# Altium project ARMBrain.PrjPCB
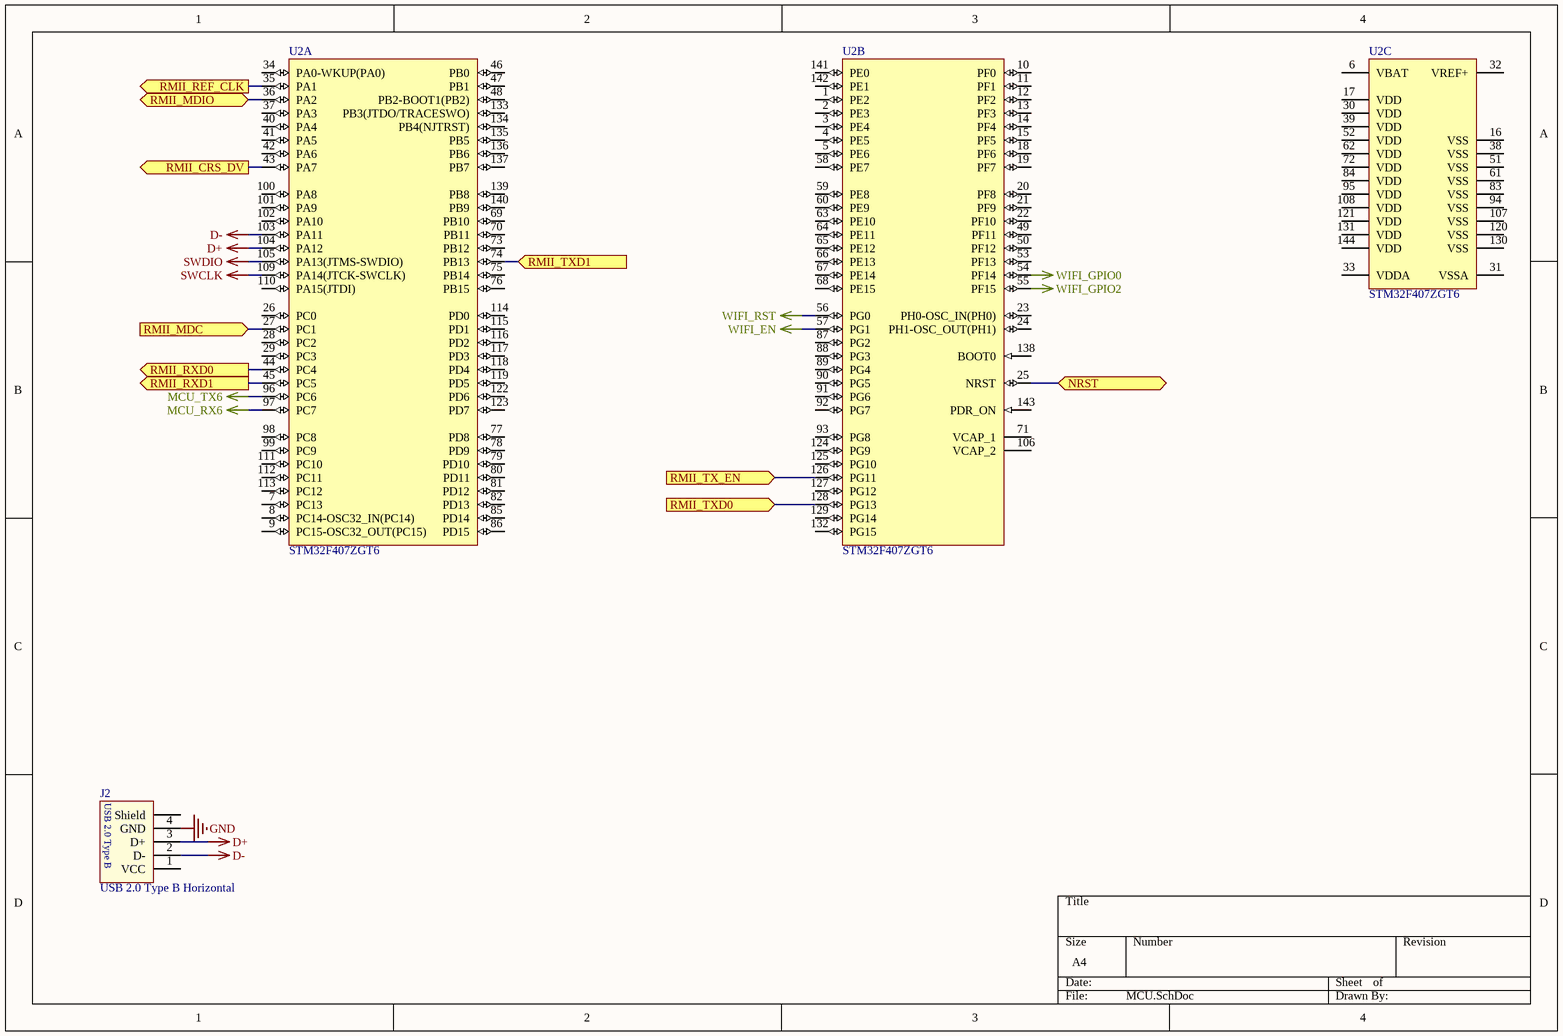
[diagram p0: MCU.SchDoc]
4 sheets, 67 parts. Net scope: flat (ports and power ports of the same name join across sheets).
Board file: ARMBrain.PcbDoc
Sheets:
  MCU.SchDoc
  Debugging.SchDoc
  ESP8266.SchDoc
  Ethernet.SchDoc

## Sheet MCU.SchDoc
size A4

### Parts
J2  USB 2.0 Type B Horizontal  [61400416121]
U2  STM32F407ZGT6  [STM-LQFP144_N]  (parts A,B,C of 3)

### Ports
NRST, RMII_CRS_DV (out), RMII_MDC (in), RMII_MDIO (bidir), RMII_REF_CLK (out), RMII_RXD0 (out), RMII_RXD1 (out), RMII_TX_EN (in), RMII_TXD0 (in), RMII_TXD1 (in)

### Nets
D+: J2.3(D+) U2.104(PA12)
D-: J2.2(D-) U2.103(PA11)
GND: J2.4(GND)  [project net RJ45_Shield]
MCU_RX6: U2.97(PC7)
MCU_TX6: U2.96(PC6)
SWCLK: U2.109(PA14(JTCK-SWCLK))
SWDIO: U2.105(PA13(JTMS-SWDIO))
WIFI_EN: U2.57(PG1)
WIFI_GPIO0: U2.54(PF14)
WIFI_GPIO2: U2.55(PF15)
WIFI_RST: U2.56(PG0)
NetR16_2: U2.44(PC4) ; port RMII_RXD0
NetR17_2: U2.45(PC5) ; port RMII_RXD1
NetR24_2: U2.43(PA7) ; port RMII_CRS_DV
NetR25_1: U2.36(PA2) ; port RMII_MDIO
NetR27_2: U2.35(PA1) ; port RMII_REF_CLK
NetU2_25: U2.25(NRST) ; port NRST
NetU2_27: U2.27(PC1) ; port RMII_MDC
NetU2_74: U2.74(PB13) ; port RMII_TXD1
NetU2_126: U2.126(PG11) ; port RMII_TX_EN
NetU2_128: U2.128(PG13) ; port RMII_TXD0

Not connected (* = marked no-connect by the designer): J2 1(VCC) Shell(Shield); U2 1(PE2) 2(PE3) 3(PE4) 4(PE5) 5(PE6) 6(VBAT) 7(PC13) 8(PC14-OSC32_IN(PC14)) 9(PC15-OSC32_OUT(PC15)) 10(PF0) 11(PF1) 12(PF2) 13(PF3) 14(PF4) 15(PF5) 16(VSS) 17(VDD) 18(PF6) 19(PF7) 20(PF8) 21(PF9) 22(PF10) 23(PH0-OSC_IN(PH0)) 24(PH1-OSC_OUT(PH1)) 26(PC0) 28(PC2) 29(PC3) 30(VDD) 31(VSSA) 32(VREF+) 33(VDDA) 34(PA0-WKUP(PA0)) 37(PA3) 38(VSS) 39(VDD) 40(PA4) 41(PA5) 42(PA6) 46(PB0) 47(PB1) 48(PB2-BOOT1(PB2)) 49(PF11) 50(PF12) 51(VSS) 52(VDD) 53(PF13) 58(PE7) 59(PE8) 60(PE9) 61(VSS) 62(VDD) 63(PE10) 64(PE11) 65(PE12) 66(PE13) 67(PE14) 68(PE15) 69(PB10) 70(PB11) 71(VCAP_1) 72(VDD) 73(PB12) 75(PB14) 76(PB15) 77(PD8) 78(PD9) 79(PD10) 80(PD11) 81(PD12) 82(PD13) 83(VSS) 84(VDD) 85(PD14) 86(PD15) 87(PG2) 88(PG3) 89(PG4) 90(PG5) 91(PG6) 92(PG7) 93(PG8) 94(VSS) 95(VDD) 98(PC8) 99(PC9) 100(PA8) 101(PA9) 102(PA10) 106(VCAP_2) 107(VSS) 108(VDD) 110(PA15(JTDI)) 111(PC10) 112(PC11) 113(PC12) 114(PD0) 115(PD1) 116(PD2) 117(PD3) 118(PD4) 119(PD5) 120(VSS) 121(VDD) 122(PD6) 123(PD7) 124(PG9) 125(PG10) 127(PG12) 129(PG14) 130(VSS) 131(VDD) 132(PG15) 133(PB3(JTDO/TRACESWO)) 134(PB4(NJTRST)) 135(PB5) 136(PB6) 137(PB7) 138(BOOT0) 139(PB8) 140(PB9) 141(PE0) 142(PE1) 143(PDR_ON) 144(VDD)

### Notes on the sheet
- (in symbol USB 2.0 Type B Horizontal) USB 2.0 Type B

### Library data of the parts
J2 = USB 2.0 Type B Horizontal: USB 2.0 Type B Horizontal WR-COM; Interface Type: Type B; Sub-Family: USB 2.0; Gender: Receptacle; ComponentLink1Description: Manufacturer; ComponentLink1URL: http://www.we-online.de; ComponentLink2Description: Datasheet; ComponentLink2URL: http://katalog.we-online.de/em/datasheet/61400416121.pdf; Part Number: 61400416121; Published Date: April 2017; Publisher: Wurth Elektronik; Type: Horizontal; Construction: THT
U2 = STM32F407ZGT6: ARM Cortex-M4 32-bit MCU+FPU, 210 DMIPS, 1024 kB Flash, 192 kB Internal RAM, 114 I/Os, 144-pin LQFP, -40 to 85 degC, Tray; Manufacturer: STMicroelectronics; D/A Converter: 2x12-bit; FLASH Size (Prog) (kB): 1024; I/Os (High Current): 114; Internal RAM Size (kB): 192; Operating Frequency(F) (Processor speed) (MHz): 168; Supply Voltage(Vcc) max (V): 3.6; Supply Voltage(Vcc) min (V): 1.8; DatasheetVersion: Rev. 4; PackageVersion: Rev. 4, 06/2013; PackageReference: LQFP144; PackageDescription: 144-Pin Low Profile Quad Flat Package, 20 x 20 mm Body, 0.5 mm Pitch; Supplier 1: Digi-Key; Supplier Part Number 1: 497-11766-ND; Supplier 2: Newark; Supplier Part Number 2: 73T2334; Supplier 3: Mouser; Supplier Part Number 3: 511-STM32F407ZGT6; Core: ARM Cortex-M4; Packing: Tray; Mounting Technology: Surface Mount; PartNumber: STM32F407ZGT6; ComponentLink1Description: Manufacturer URL; ComponentLink1URL: http://www.st.com/web/en/home.html; ComponentLink2Description: Datasheet; ComponentLink2URL: http://www.st.com/st-web-ui/static/active/en/resource/technical/document/datasheet/DM00037051.pdf; ComponentLink3Description: Package Specification; ComponentLink3URL: http://www.st.com/st-web-ui/static/active/en/resource/technical/document/datasheet/DM00037051.pdf

## Sheet Debugging.SchDoc
size A4
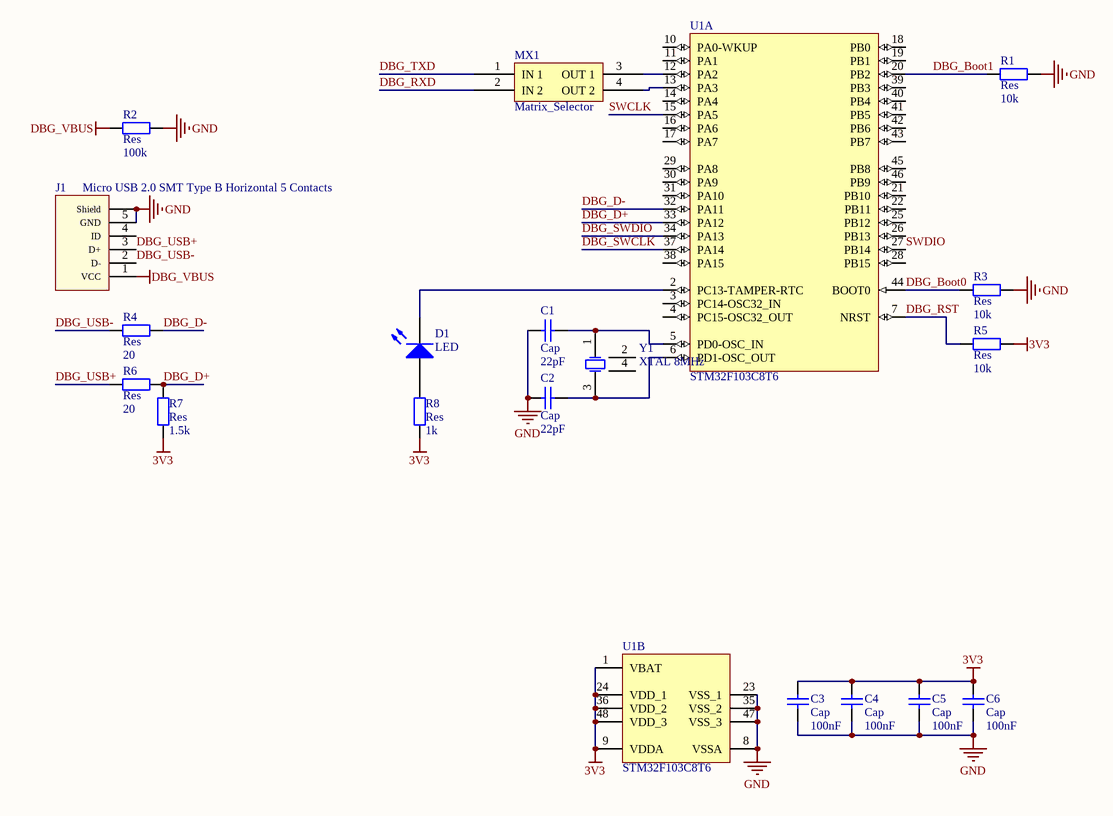
[diagram p1: Debugging.SchDoc]

### Parts
C1  Cap  value 22pF  [C0603]
C2  Cap  value 22pF  [C0603]
C3  Cap  value 100nF  [C0603]
C4  Cap  value 100nF  [C0603]
C5  Cap  value 100nF  [C0603]
C6  Cap  value 100nF  [C0603]
D1  LED  [0805_Led]
J1  Micro USB 2.0 SMT Type B Horizontal 5 Contacts  [629105136821]
MX1  Matrix_Selector  [Matrix_Selector]
R1  Res  value 10k  [R0805]
R2  Res  value 100k  [R0805]
R3  Res  value 10k  [R0805]
R4  Res  value 20  [R0805]
R5  Res  value 10k  [R0805]
R6  Res  value 20  [R0805]
R7  Res  value 1.5k  [R0805]
R8  Res  value 1k  [R0805]
U1  STM32F103C8T6  [STM-LQFP48_N]  (parts A,B of 2)
Y1  XTAL 8MHz  [SMD-3225_4P]

### Nets
3V3: C3.2 C4.2 C5.2 C6.2 R5.2 R7.1 R8.1 U1.1(VBAT) U1.9(VDDA) U1.24(VDD_1) U1.36(VDD_2) U1.48(VDD_3)
DBG_VBUS: J1.1(VCC) R2.2
GND: C1.1 C2.1 C3.1 C4.1 C5.1 C6.1 J1.5(GND) J1.Shell(Shield) R1.2 R2.1 R3.2 U1.8(VSSA) U1.23(VSS_1) U1.35(VSS_2) U1.47(VSS_3)  [project net RJ45_Shield]
DBG_Boot0: R3.1 U1.44(BOOT0)
DBG_Boot1: R1.1 U1.20(PB2)
DBG_D+: R6.2 R7.2 U1.33(PA12)
DBG_D-: R4.2 U1.32(PA11)
DBG_RST: R5.1 U1.7(NRST)
DBG_RXD: MX1.2(IN_2)
DBG_SWCLK: U1.37(PA14)
DBG_SWDIO: U1.34(PA13)
DBG_TXD: MX1.1(IN_1)
DBG_USB+: J1.3(D+) R6.1
DBG_USB-: J1.2(D-) R4.1
SWCLK: U1.15(PA5)
SWDIO: U1.27(PB14)
NetC1_2: C1.2 U1.5(PD0-OSC_IN) Y1.1(OSC1)
NetC2_2: C2.2 U1.6(PD1-OSC_OUT) Y1.3(OSC2)
NetD1_1: D1.1(K) U1.2(PC13-TAMPER-RTC)
NetD1_2: D1.2(A) R8.2
NetMX1_3: MX1.3(OUT_1) U1.12(PA2)
NetMX1_4: MX1.4(OUT_2) U1.13(PA3)

Not connected (* = marked no-connect by the designer): J1 4(ID); U1 3(PC14-OSC32_IN) 4(PC15-OSC32_OUT) 10(PA0-WKUP) 11(PA1) 14(PA4) 16(PA6) 17(PA7) 18(PB0) 19(PB1) 21(PB10) 22(PB11) 25(PB12) 26(PB13) 28(PB15) 29(PA8) 30(PA9) 31(PA10) 38(PA15) 39(PB3) 40(PB4) 41(PB5) 42(PB6) 43(PB7) 45(PB8) 46(PB9); Y1 2(OSC1) 4(OSC1)

### Library data of the parts
C1-C6 = Cap: Capacitor; Published: 8-Jun-2000; LatestRevisionDate: 17-Jul-2002; LatestRevisionNote: Re-released for DXP Platform.; PackageReference: RAD-0.3; Publisher: Altium Limited; PackageDescription: Radial Cap, Thru-Hole; 2 Leads; 0.3 in Pin Spacing
D1 = LED: SMD LED; PCB_Layout: Complies with manufacturer's recommendation.; Published: 14-Mar-2008; DatasheetVersion: Mar-2007; PackageVersion: Mar-2007; PackageReference: LWP4SG; Publisher: Altium Limited; PackageDescription: White LED; 2 Reverse Gullwing Leads, Body 1.9 x 0.875mm (Dia.xH); ComponentLink1Description: Manufacturer Link; ComponentLink1URL: http://www.osram-os.com/; ComponentLink2Description: Datasheet; ComponentLink2URL: http://catalog.osram-os.com/catalogue/catalogue.do;jsessionid=AD571800CED0208623E7FAFDF556DB1C?act=downloadFile&favOid=020000030001e106000200b6
J1 = Micro USB 2.0 SMT Type B Horizontal 5 Contacts: Micro USB 2.0 SMT Type B Horizontal 5 Contacts WR-COM; Interface Type: Type B; Gender: Receptacle; ComponentLink1Description: Manufacturer; ComponentLink1URL: http://www.we-online.de; ComponentLink2Description: Datasheet; ComponentLink2URL: http://katalog.we-online.de/em/datasheet/629105136821.pdf; Part Number: 629105136821; Published Date: April 2017; Publisher: Wurth Elektronik; Sub-Family: Micro USB 2.0; Type: Horizontal; Construction: SMT
R1-R8 = Res: Resistor; Published: 8-Jun-2000; LatestRevisionDate: 17-Jul-2002; LatestRevisionNote: Re-released for DXP Platform.; PackageReference: AXIAL-0.4; Publisher: Altium Limited; PackageDescription: Axial Device, Thru-Hole; 2 Leads; 0.4 in Pin Spacing
U1 = STM32F103C8T6: ARM Cortex-M3 32-bit MCU, 64 KB Flash, 20 KB Internal RAM, 37 I/Os, 48-pin LQFP, -40 to 85 degC, Tray; A/D Converter: 2x12-bit (10 Channel); FLASH Size (Prog) (kB): 64; I/Os (High Current): 37; Internal RAM Size (kB): 20; Operating Frequency(F) (Processor speed) (MHz): 72; Supply Voltage(Vcc) min (V): 2; DatasheetVersion: Rev. 16; PackageVersion: Rev. 6, 06/2013; PackageReference: LQFP48; PackageDescription: 48-Pin Low Profile Quad Flat Package, 7 x 7 mm Body, 0.5 mm Pitch; Supplier 1: Digi-Key; Supplier Part Number 1: 497-6063-ND; Supplier 2: Farnell; Supplier Part Number 2: 1447637; Supplier 3: Newark; Supplier Part Number 3: 59M2182; Supplier 4: Newark; Supplier Part Number 4: 57P1222; Supplier 5: Mouser; Supplier Part Number 5: 511-STM32F103C8T6; Core: ARM Cortex-M3; Packing: Tray; Mounting Technology: Surface Mount; PartNumber: STM32F103C8T6; ComponentLink1Description: Manufacturer URL; ComponentLink1URL: http://www.st.com/web/en/home.html; ComponentLink2Description: Datasheet; ComponentLink2URL: http://www.st.com/st-web-ui/static/active/en/resource/technical/document/datasheet/CD00161566.pdf; ComponentLink3Description: Package Specification; ComponentLink3URL: http://www.st.com/st-web-ui/static/active/en/resource/technical/document/datasheet/DM00058181.pdf
Y1 = XTAL_SMD: Crystal; Published: 8-Jun-2000; LatestRevisionDate: 17-Jul-2002; LatestRevisionNote: Re-released for DXP Platform.; PackageReference: R38; Publisher: Altium Limited; PackageDescription: Crystal, Thru-Hole; 2 Leads; Body 3.1 x 8.2 mm (Dia.xH)

## Sheet ESP8266.SchDoc
size A4
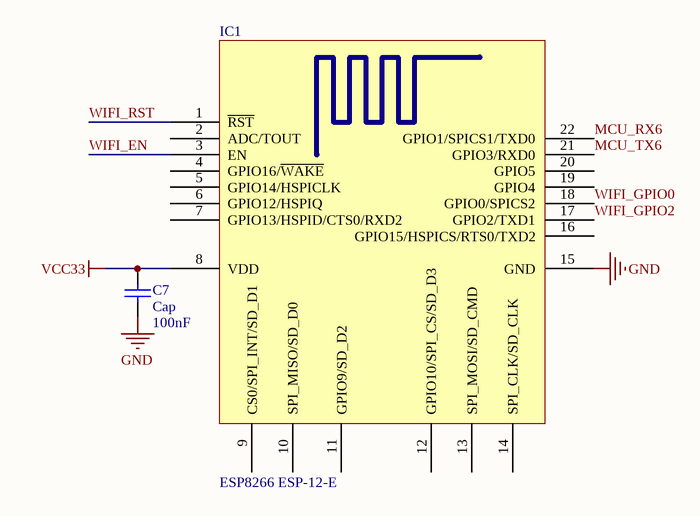
[diagram p2: ESP8266.SchDoc]

### Parts
C7  Cap  value 100nF  [C0603]
IC1  ESP8266 ESP-12-E  [ESP8266 ESP-12-E]

### Nets
GND: C7.1 IC1.15(GND)  [project net RJ45_Shield]
VCC33: C7.2 IC1.8(VDD)
MCU_RX6: IC1.22(GPIO1/SPICS1/TXD0)
MCU_TX6: IC1.21(GPIO3/RXD0)
WIFI_EN: IC1.3(EN)
WIFI_GPIO0: IC1.18(GPIO0/SPICS2)
WIFI_GPIO2: IC1.17(GPIO2/TXD1)
WIFI_RST: IC1.1(~{RST})

Not connected (* = marked no-connect by the designer): IC1 2(ADC/TOUT) 4(GPIO16/~{WAKE}) 5(GPIO14/HSPICLK) 6(GPIO12/HSPIQ) 7(GPIO13/HSPID/CTS0/RXD2) 9(CS0/SPI_INT/SD_D1) 10(SPI_MISO/SD_D0) 11(GPIO9/SD_D2) 12(GPIO10/SPI_CS/SD_D3) 13(SPI_MOSI/SD_CMD) 14(SPI_CLK/SD_CLK) 16(GPIO15/HSPICS/RTS0/TXD2) 19(GPIO4) 20(GPIO5)

### Library data of the parts
C7 = Cap: Capacitor; Published: 8-Jun-2000; LatestRevisionDate: 17-Jul-2002; LatestRevisionNote: Re-released for DXP Platform.; PackageReference: RAD-0.3; Publisher: Altium Limited; PackageDescription: Radial Cap, Thru-Hole; 2 Leads; 0.3 in Pin Spacing

## Sheet Ethernet.SchDoc
size A4
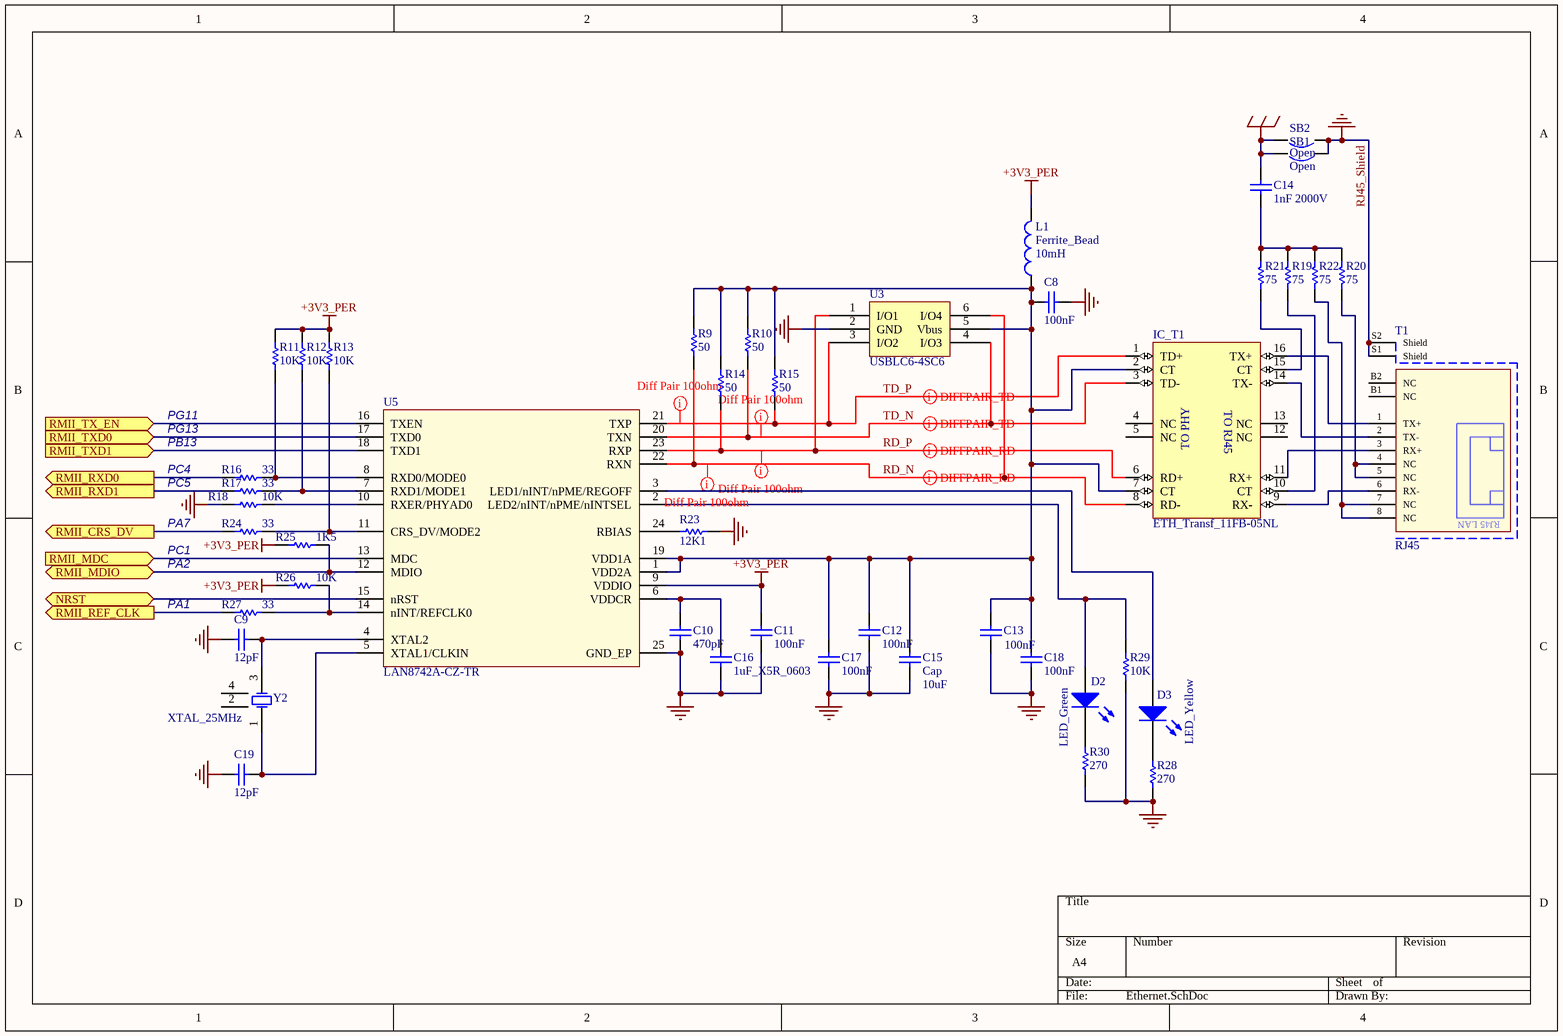
[diagram p3: Ethernet.SchDoc]

### Parts
C8  100nF  [C0603]
C9  12pF  [C0603]
C10  470pF  [C0603]
C11  100nF  [C0603]
C12  100nF  [C0603]
C13  100nF  [C0603]
C14  1nF 2000V  [C1206]
C15  Cap  value 10uF  [C0805]
C16  1uF_X5R_0603  [C0603]
C17  100nF  [C0603]
C18  100nF  [C0603]
C19  12pF  [C0603]
D2  LED_Green  [0603_LED]
D3  LED_Yellow  [0603_LED]
IC_T1  ETH_Transf_11FB-05NL  [ETH_Transf 11FB-05NL]
L1  Ferrite_Bead  value 10mH  [0805]
R9  50  [R0603]
R10  50  [R0603]
R11  10K  [R0603]
R12  10K  [R0603]
R13  10K  [R0603]
R14  50  [R0603]
R15  50  [R0603]
R16  33  [R0603]
R17  33  [R0603]
R18  10K  [R0603]
R19  75  [R0603]
R20  75  [R0603]
R21  75  [R0603]
R22  75  [R0603]
R23  12K1  [R0805]
R24  33  [R0603]
R25  1K5  [R0603]
R26  10K  [R0603]
R27  33  [R0603]
R28  270  [R0603]
R29  10K  [R0603]
R30  270  [R0603]
SB1  Open  [SB_0603]
SB2  Open  [SB_0603]
T1  RJ45  [RJ45_ETH]
U3  USBLC6-4SC6  [SOT23-6L]
U5  LAN8742A-CZ-TR  [QFN24_0R5_4X4]
Y2  XTAL_25MHz  [SMD-3225_4P]

### Ports
NRST, RMII_CRS_DV (out), RMII_MDC (in), RMII_MDIO (bidir), RMII_REF_CLK (out), RMII_RXD0 (out), RMII_RXD1 (out), RMII_TX_EN (in), RMII_TXD0 (in), RMII_TXD1 (in)

### Nets
+3V3_PER: C11.2 L1.2 R11.1 R12.1 R13.1 R25.2 R26.1 U5.9(VDDIO)
EGND: C14.1 SB1.1 SB2.1
RJ45_Shield: C8.1 C9.2 C10.1 C11.1 C12.1 C13.1 C15.1 C16.2 C17.1 C18.1 C19.2 R18.2 R23.2 R28.2 R29.2 R30.2 SB1.2 SB2.2 T1.S1(Shield) T1.S2(Shield) U3.2(GND) U5.25(GND_EP)  [also labelled GND]
RD_N: IC_T1.8(RD-) R9.1 U3.6(I/O4) U5.22(RXN)
RD_P: IC_T1.6(RD+) R14.1 U3.1(I/O1) U5.23(RXP)
TD_N: IC_T1.3(TD-) R10.1 U3.4(I/O3) U5.20(TXN)
TD_P: IC_T1.1(TD+) R15.1 U3.3(I/O2) U5.21(TXP)
NetC8_2: C8.2 C12.2 C13.2 C15.2 C17.2 C18.2 IC_T1.2(CT) IC_T1.7(CT) L1.1 R9.2 R10.2 R14.2 R15.2 U3.5(Vbus) U5.1(VDD2A) U5.19(VDD1A)
NetC9_1: C9.1 U5.4(XTAL2) Y2.3(OSC2)
NetC10_2: C10.2 C16.1 U5.6(VDDCR)
NetC14_2: C14.2 R19.1 R20.1 R21.1 R22.1
NetC19_1: C19.1 U5.5(XTAL1/CLKIN) Y2.1(OSC1)
NetD2_1: D2.1(K) R30.1
NetD2_2: D2.2(A) R29.1 U5.2(LED2/nINT/nPME/nINTSEL)
NetD3_1: D3.1(K) R28.1
NetD3_2: D3.2(A) U5.3(LED1/nINT/nPME/REGOFF)
NetIC_T1_9: IC_T1.9(RX-) T1.6(RX-)
NetIC_T1_10: IC_T1.10(CT) R19.2
NetIC_T1_11: IC_T1.11(RX+) T1.3(RX+)
NetIC_T1_14: IC_T1.14(TX-) T1.2(TX-)
NetIC_T1_15: IC_T1.15(CT) R21.2
NetIC_T1_16: IC_T1.16(TX+) T1.1(TX+)
NetR11_2: R11.2 R16.1 U5.8(RXD0/MODE0)
NetR12_2: R12.2 R17.1 U5.7(RXD1/MODE1)
NetR13_2: R13.2 R24.1 U5.11(CRS_DV/MODE2)
NetR16_2: R16.2 ; port RMII_RXD0
NetR17_2: R17.2 ; port RMII_RXD1
NetR18_1: R18.1 U5.10(RXER/PHYAD0)
NetR20_2: R20.2 T1.4(NC) T1.5(NC)
NetR22_2: R22.2 T1.7(NC) T1.8(NC)
NetR23_1: R23.1 U5.24(RBIAS)
NetR24_2: R24.2 ; port RMII_CRS_DV
NetR25_1: R25.1 U5.12(MDIO) ; port RMII_MDIO
NetR26_2: R26.2 R27.1 U5.14(nINT/REFCLK0)
NetR27_2: R27.2 ; port RMII_REF_CLK
NetU2_25: U5.15(nRST) ; port NRST
NetU2_27: U5.13(MDC) ; port RMII_MDC
NetU2_74: U5.18(TXD1) ; port RMII_TXD1
NetU2_126: U5.16(TXEN) ; port RMII_TX_EN
NetU2_128: U5.17(TXD0) ; port RMII_TXD0

Not connected (* = marked no-connect by the designer): IC_T1 4(NC) 5(NC) 12(NC) 13(NC); T1 B1(NC) B2(NC); Y2 2(OSC1) 4(OSC1)

### Layout directives
differential pair: RD_N, RD_P, TD_N, TD_P
rule Matched Net Lengths [Tolerance = 100mil]: RD_N, RD_P, TD_N, TD_P

### Notes on the sheet
- PG11
- PG13
- PB13
- PC4
- PC5
- PA7
- PC1
- PA2
- PA1
- (in symbol ETH_Transf_11FB-05NL) TO RJ45; TO PHY
- (in symbol RJ45) RJ45 LAN

### Library data of the parts
C8 C11-C13 C17 C18 = Capacitor_ST: Capacitor 0402 / 0603 / 0805; Revision: July-2002: Re-released for DXP Platform.; Value: 100nF
C9 C10 C19 = Capacitor_ST: Capacitor 0402 / 0603 / 0805; Value: 100nF; Revision: July-2002: Re-released for DXP Platform.
C14 = Capacitor_ST: Capacitor 0402 / 0603 / 0805/ 1206; Value: 100nF; Revision: July-2002: Re-released for DXP Platform.
C15 = Cap: Capacitor; Published: 8-Jun-2000; LatestRevisionDate: 17-Jul-2002; LatestRevisionNote: Re-released for DXP Platform.; PackageReference: RAD-0.3; Publisher: Altium Limited; PackageDescription: Radial Cap, Thru-Hole; 2 Leads; 0.3 in Pin Spacing
C16 = CAP SMD 0603  X5R 1µF 25V 10%: 0603  X5R 1µF; Rated voltage: 25V; Tolerance: 10%; Manufacturer: *; Manufacturer P/N: *; Order code Farnell: 1288202RL; Value: 1µF; Power: *; Technology: X5R; Temperature  Factor: *; Temperature Max: +125°C; Temperature Min: -55°C; STS Code: *
D2 D3 = LED: as D1 on sheet Debugging; Published: 14-Mar-2008; DatasheetVersion: Mar-2007; PackageVersion: Mar-2007; PackageReference: LWP4SG; Publisher: Altium Limited; PackageDescription: White LED; 2 Reverse Gullwing Leads, Body 1.9 x 0.875mm (Dia.xH); ComponentLink1Description: Manufacturer Link; ComponentLink1URL: http://www.osram-os.com/; ComponentLink2Description: Datasheet; ComponentLink2URL: http://catalog.osram-os.com/catalogue/catalogue.do;jsessionid=AD571800CED0208623E7FAFDF556DB1C?act=downloadFile&favOid=020000030001e106000200b6
L1 = Ferrite_Bead: Code_IEC: 1005; Published: 8-Jun-2000; LatestRevisionDate: 29-May-2009; LatestRevisionNote: IPC-7351 Footprint Added.; PackageReference: 0402-A; Publisher: Altium Limited; PackageDescription: Chip Inductor; Code_JEITA: 0402
R9 R10 R14 R15 = Res_50_1%_0603: Resistor,50,0603,1%,YAGEO; Manuf_Part_1: RC0402FR-0750RL; Value: 50; Manuf_1: YAGEO; Order: *; ECCN_US/EU: n/a; Distrib: FARNELL
R11-R13 R18 R26 R29 = Resistor_ST: Resistor 0402 / 0603 / 0805; Value: 10K
R16 R17 R24 R27 = Res_33_1%_0402: Resistor,33,0402,1%,YAGEO; Manuf_Part_1: RC0402FR-0733RL; Value: 33; Manuf_1: YAGEO; Order: *; ECCN_US/EU: n/a; Distrib: FARNELL
R19-R22 = Res_75_1%_0603: Resistor,75,0603,1%,YAGEO; Manuf_Part_1: RC0402FR-0750RL; Value: 50; Manuf_1: YAGEO; Order: *; ECCN_US/EU: n/a; Distrib: FARNELL
R23 = Res_12K1_1%_0603: Resistor,12K1,0603,1%,VISHAY; Manuf_Part_1: MCT 0603-50 1% P5 12K1; Order: 2325243; Value: 12K1; ECCN_US/EU: n/a; Manuf_1: VISHAY; Distrib: FARNELL
R25 = Res_1K5_1%_0402: Resistor,1K5,0402,1%,YAGEO; Manuf_Part_1: RC0402FR-071K5L; Value: 1K5; Manuf_1: YAGEO; Order: RC0402FR-071K5L; ECCN_US/EU: n/a; Distrib: FARNELL
R28 R30 = Resistor_ST: Resistor 0402 / 0603 / 0805; Value: 10K
SB1 SB2 = Circuit Breaker: Published: 24-Mar-1999; Revision: July-2002: Re-released for DXP Platform.; Publisher: Altium Limited
T1 = RJ45: WE-RJ45 LAN Transformer, 10/100 Base-T, THT, Port 1x1, Tab Up; Part Number: 7499010003A; PoE: non-PoE; LED (Left-Right): –; USB: No; ComponentLink1Description: Manufacturer; ComponentLink1URL: http://www.we-online.de; ComponentLink2Description: Datasheet; ComponentLink2URL: http://katalog.we-online.de/pbs/datasheet/7499010003A.pdf; Published Date: Dec. 2017; Publisher: Wurth Elektronik; Tab Position: Up; Port Number: 1x1; Data Rate: 10/100 Base-T; Operating Temperature: -40 to +85 degC; Mounting Technology: THT
U5 = LAN8742A-CZ-TR: LAN8742A-CZ-TR - Small Footprint RMII 10/100 Ethernet, Transceiver with HP Auto-MDIX and flexPWR Technology SQFN-24; Manuf_1: MICROCHIP; Order: LAN8742A-CZ-TR; Manuf_Part_1: LAN8742A-CZ-TR; Distrib: MICROCHIP
Y2 = XTAL_SMD: Crystal; Published: 8-Jun-2000; LatestRevisionDate: 17-Jul-2002; LatestRevisionNote: Re-released for DXP Platform.; PackageReference: R38; Publisher: Altium Limited; PackageDescription: Crystal, Thru-Hole; 2 Leads; Body 3.1 x 8.2 mm (Dia.xH)

## Nets that join several sheets
RJ45_Shield: MCU (J2.4), Debugging (15 pins), ESP8266 (C7.1 IC1.15), Ethernet (22 pins)
NetR16_2: MCU (U2.44), Ethernet (R16.2)
NetR17_2: MCU (U2.45), Ethernet (R17.2)
NetR24_2: MCU (U2.43), Ethernet (R24.2)
NetR25_1: MCU (U2.36), Ethernet (R25.1 U5.12)
NetR27_2: MCU (U2.35), Ethernet (R27.2)
NetU2_25: MCU (U2.25), Ethernet (U5.15)
NetU2_27: MCU (U2.27), Ethernet (U5.13)
NetU2_74: MCU (U2.74), Ethernet (U5.18)
NetU2_126: MCU (U2.126), Ethernet (U5.16)
NetU2_128: MCU (U2.128), Ethernet (U5.17)